# Altium schematic sheet OptoInterface.SchDoc
size 420 x 297 mm; DocumentNumber: 3; SheetNumber: 1; SheetTotal: 3
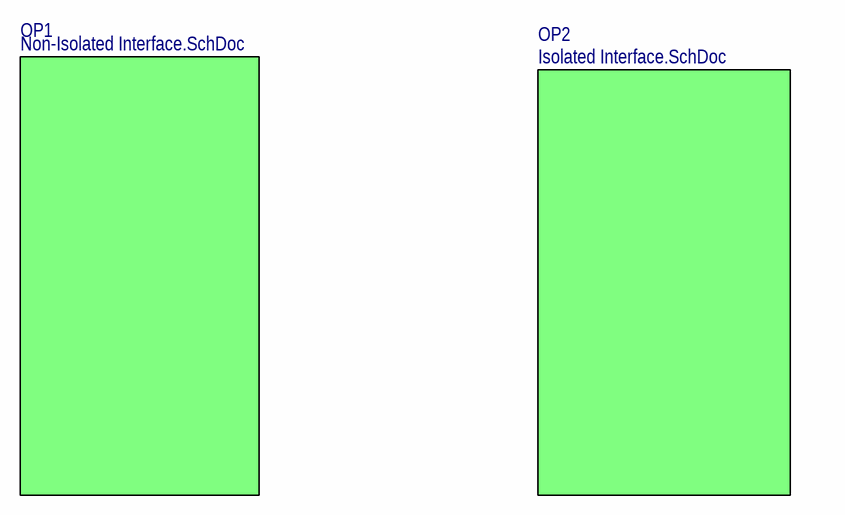
[diagram p0: OptoInterface.SchDoc]

## Sub-sheets
OP1 = Non-Isolated Interface.SchDoc: no entries
OP2 = Isolated Interface.SchDoc: no entries

## Notes on the sheet
- Подп. дата
- Инв. № дубл.
- Взам. инв. №
- Подп. и дата
- Инв. № подл.
- Изм.
- Лист
- № докум.
- Подп.
- Дата
- ALTIUM GOSTBOM2.0 KEV
- Файл:
- Копировал
- Формат А3